# Altium project E_tactile.PrjPcb
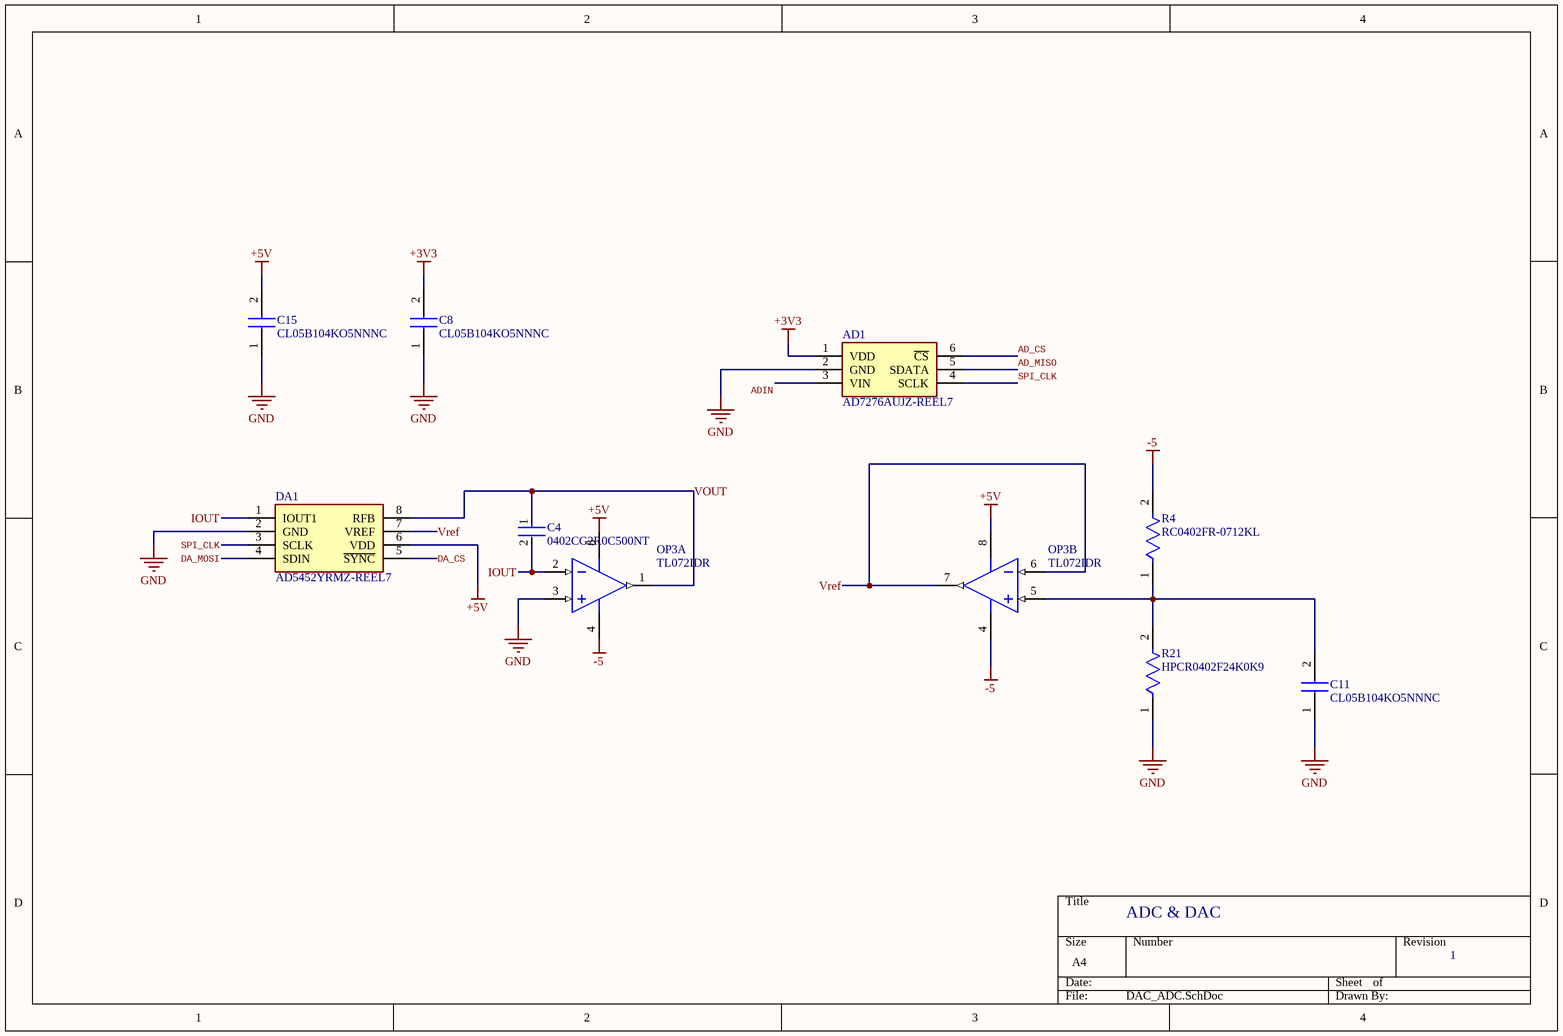
[diagram p0: DAC_ADC.SchDoc]
5 sheets, 67 parts. Net scope: global (net labels, ports and power ports of the same name join across sheets).
Board file: PCB_main_single_side_STACK.PcbDoc
Sheets:
  DAC_ADC.SchDoc
  boost_converter.SchDoc
  current_mirror.SchDoc
  processor.SchDoc
  vreg.SchDoc

## Sheet DAC_ADC.SchDoc
size A4; Revision: 1; SheetNumber: 1; SheetTotal: 5

### Parts
AD1  AD7276AUJZ-REEL7  [SOT95P280X100-6N]
C4  0402CG2R0C500NT  [FP-GJM155-0_05-IPC_C]
C8  CL05B104KO5NNNC  [CAPC1005X55N]
C11  CL05B104KO5NNNC  [CAPC1005X55N]
C15  CL05B104KO5NNNC  [CAPC1005X55N]
DA1  AD5452YRMZ-REEL7  [SOP65P490X110-8N]
OP3  TL072IDR  [D0008A_L]  (parts A,B of 2)
R4  RC0402FR-0712KL  [FP-RC0402-0_4-IPC_C]
R21  HPCR0402F24K0K9  [FP-RT0402-MFG]

### Nets
+3V3: AD1.1(VDD) C8.2
+5V: C15.2 DA1.6(VDD) OP3.8(VCC+)
-5: OP3.4(VCC-) R4.2
GND: AD1.2(GND) C8.1 C11.1 C15.1 DA1.2(GND) OP3.3(IN1+) R21.1
AD_CS: AD1.6(~{CS})
AD_MISO: AD1.5(SDATA)
ADIN: AD1.3(VIN)
DA_CS: DA1.5(~{SYNC})
DA_MOSI: DA1.4(SDIN)
IOUT: C4.2 DA1.1(IOUT1) OP3.2(IN1-)
SPI_CLK: AD1.4(SCLK) DA1.3(SCLK)
VOUT: C4.1 DA1.8(RFB) OP3.1(OUT1)
Vref: DA1.7(VREF) OP3.6(IN2-) OP3.7(OUT2)
NetC11_2: C11.2 OP3.5(IN2+) R4.1 R21.2

### Notes on the sheet
- ADC & DAC
- 1

### Library data of the parts
AD1 = AD7276AUJZ-REEL7: Integrated Circuit; Manufacturer_Name: Analog Devices; Datasheet Link: http://componentsearchengine.com/Datasheets/1/AD7276AUJZ-REEL7.pdf; Height: 1mm; Manufacturer_Part_Number: AD7276AUJZ-REEL7; Mouser Part Number: 584-AD7276AUJZ-R7; Mouser Price/Stock: https://www.mouser.co.uk/ProductDetail/Analog-Devices/AD7276AUJZ-REEL7?qs=NmRFExCfTkGcJMyUALbIIQ%3D%3D; Arrow Part Number: AD7276AUJZ-REEL7; Arrow Price/Stock: https://www.arrow.com/en/products/ad7276aujz-reel7/analog-devices
C4 = CMP-2008-03830-2: Multi-Layer Ceramic Capacitor 2pF C0G  ±0.1pF 0402 Paper T/R; Voltage Rating: 50V; Mount: Surface Mount; REACH SVHC: No SVHC; Lead Pitch: 0.3mm; Length: 1mm; Lead Free: Lead Free; Radiation Hardening: No; Depth: 0.5mm; Thickness: 0.022inch; Number of Pins: 2; Height: 0.5mm; Min Operating Temperature: -55°C; Width: 0.5mm; Packaging: Tape and Reel; Case Code (Metric): 1005; Capacitance: 2pF; Voltage Rating (DC): 50V; Package Quantity: 1; Max Operating Temperature: 125°C; Case/Package: 0402; Case Code (Imperial): 0402; Dielectric: C0G; Termination: SMD/SMT
C8 C11 C15 = CL05B104KO5NNNC: Capacitor; Manufacturer_Name: SAMSUNG; Datasheet Link: https://datasheet.datasheetarchive.com/originals/distributors/Datasheets-DGA10/2408147.pdf; Height: 0.55mm; Manufacturer_Part_Number: CL05B104KO5NNNC; Mouser Part Number: 187-CL05B104KO5NNNC; Mouser Price/Stock: https://www.mouser.co.uk/ProductDetail/Samsung-Electro-Mechanics/CL05B104KO5NNNC?qs=hqM3L16%252BxlfT2SKOuAUq6Q%3D%3D; Arrow Part Number: CL05B104KO5NNNC; Arrow Price/Stock: https://www.arrow.com/en/products/cl05b104ko5nnnc/samsung-electro-mechanics?utm_currency=USD&region=europe
DA1 = AD5452YRMZ-REEL7: Integrated Circuit; Manufacturer_Name: Analog Devices; Datasheet Link: https://componentsearchengine.com/Datasheets/1/AD5452YRMZ-REEL7.pdf; Height: 1.1mm; Manufacturer_Part_Number: AD5452YRMZ-REEL7; Mouser Part Number: 584-AD5452YRMZ-R7; Mouser Price/Stock: https://www.mouser.co.uk/ProductDetail/Analog-Devices/AD5452YRMZ-REEL7?qs=NmRFExCfTkHoityukWLALQ%3D%3D; Arrow Part Number: AD5452YRMZ-REEL7; Arrow Price/Stock: https://www.arrow.com/en/products/ad5452yrmz-reel7/analog-devices?region=nac
OP3 = CMP-0015-00084-2: Dual Low-Noise JFET-Input General-Purpose Operational Amplifier, 7 to 36 V, -40 to 85 degC, 8-pin SOIC (D8), Green (RoHS & no Sb/Br); Manufacturer: Texas Instruments; Number of Channels: 2; Rating: Catalog; IIB(Max)(pA): 200; Total Supply Voltage(Max)(+5V is 5, +/-5V is 10): 36; Vio (25C)(Max)(mV): 6; Iq per channel(Max)(mA): 2.5; Offset Drift(Typ)(uV/C): 18; Total Supply Voltage(Min)(+5V is 5, +/-5V is 10): 7; CMRR(Min)(dB): 75; Slew Rate(Typ)(V/us): 13; Sub Family: General Purpose Amplifier, High Supply Voltage Amplifier (>=30V); GBW(Typ)(MHz): 3; Code_JEDEC: MS-012; Eco-Plan: Green (RoHS & no Sb/Br); Mounting Technology: Surface Mount; ComponentLink3Description: Package Specification; PackageReference: D0008A; ComponentLink2URL: http://www.ti.com/lit/ds/symlink/tl072.pdf; ComponentLink1Description: Manufacturer URL; ComponentLink3URL: http://www.ti.com/litv/pdf/msoi002j; ComponentLink2Description: Datasheet; DatasheetVersion: SLOS080J; ComponentLink1URL: http://www.ti.com/; PackageDescription: 8-Pin Plastic Small Outline, Body 4.9 x 3.9 mm, Pitch 1.27 mm; PackageVersion: 4040047-3/M, 06/2011; Vn at 1kHz(Typ)(nV/rtHz): 18; PartNumber: TL072IDR
R4 = CMP-2002-07378-2: RES SMD 12K OHM 1% 1/16W 0402; Power Rating: 62.5mW; Voltage Rating: 50V; Resistance: 12kR; Max Power Dissipation: 63mW; Temperature Coefficient: 100ppm/°C; Construction: Rectangular; Case Code (Metric): 1005; Package Quantity: 1; Weight: 2.3E-05oz; RoHS Compliant: Yes; Packaging: Tape and Reel; Case Code (Imperial): 0402; Military Standard: Not; Min Operating Temperature: -55°C; Depth: 0.5mm; Length: 1mm; Width: 0.02inch; Termination: SMD/SMT; Lead Free: Lead Free; Tolerance: 1%; REACH SVHC: No SVHC; Size Code: 0402; Resistance Tolerance: 1%; Series: RC; Max Operating Temperature: 155°C; Height: 0.016inch; Features: Moisture Resistant; Number of Terminations: 2; Case/Package: 0402; Resistor Type: Thick Film
R21 = CMP-03412-008661-1: RES SMD 12K OHM 1% 1/16W 0402; Manufacturer: Yageo; Temperature Coefficient: 50 ppm/°C; Voltage Rating: 50V; Tolerance: 0.01; Power Rating: 0.063W; Resistance: 24KΩ; Value: 12KΩ; ComponentLink2Description: Datasheet; Height: 0.35mm; Lead Free: Yes; Package: RT0402; Series: RT; RoHS: TRUE; Manufacturer Part Number: HPCR0402F24K0K9; ComponentLink2URL: http://www.yageo.com/documents/recent/PYu-RT_1-to-0.01_RoHS_L_9.pdf; Temperature Range Low: -55°C; Device Class L1: Passive Components; Temperature Range High: +155°C; Automotive: No; Digikey Description: RES SMD 14K OHM 1% 1/16W 0402; Ipc Land Pattern Name: RESC10050X30; Octopart: https://octopart.com/rt0402fre0714kl-yageo-1378200; Category: Res; Temperature: -55°C to +155°C; Footprint Url: http://www.yageo.com/exep/pages/download/literatures/PYu-R_Mount_10.pdf; Device Class L3: Chip SMD Resistors; Composition: Thin Film; Device Class L2: Resistors

## Sheet boost_converter.SchDoc
size A4; SheetNumber: 2; SheetTotal: 5
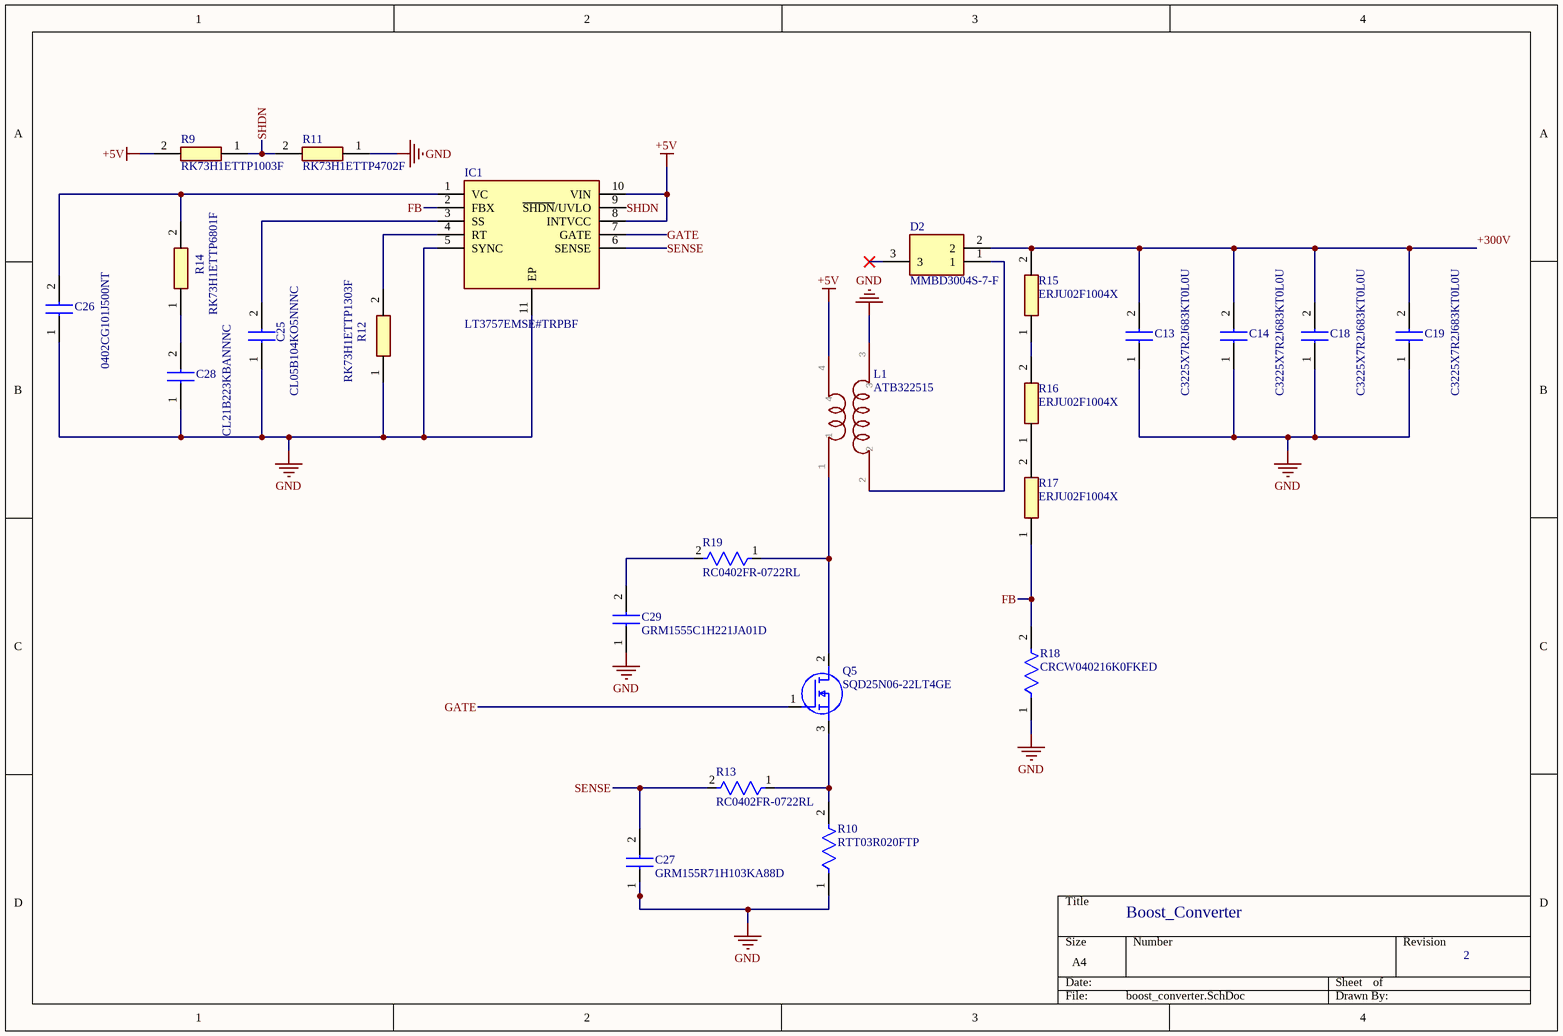
[diagram p1: boost_converter.SchDoc]

### Parts
C13  C3225X7R2J683KT0L0U  [CAPC3225X200N]
C14  C3225X7R2J683KT0L0U  [CAPC3225X200N]
C18  C3225X7R2J683KT0L0U  [CAPC3225X200N]
C19  C3225X7R2J683KT0L0U  [CAPC3225X200N]
C25  CL05B104KO5NNNC  [CAPC1005X55N]
C26  0402CG101J500NT  [CAPC1005X55N]
C27  GRM155R71H103KA88D  [GRM15x]
C28  CL21B223KBANNNC  [CAPC2012X75N]
C29  GRM1555C1H221JA01D  [CAPC1005X70N]
D2  MMBD3004S-7-F  [SOT96P240X100-3N]
IC1  LT3757EMSE#TRPBF  [SOP50P490X110-11N]
L1  ATB322515  [ATB322515]
Q5  SQD25N06-22LT4GE  [IPD25N06S4L30ATMA2]
R9  RK73H1ETTP1003F  [RESC1005X40N]
R10  RTT03R020FTP  [FP-PA0402-MFG]
R11  RK73H1ETTP4702F  [RESC1005X40N]
R12  RK73H1ETTP1303F  [RESC1005X40N]
R13  RC0402FR-0722RL  [FP-RC0402-0_4-MFG]
R14  RK73H1ETTP6801F  [RESC1005X40N]
R15  ERJU02F1004X  [ERJS02_U02_(0402)]
R16  ERJU02F1004X  [ERJS02_U02_(0402)]
R17  ERJU02F1004X  [ERJS02_U02_(0402)]
R18  CRCW040216K0FKED  [FP-CRCW0402-e3-IPC_C]
R19  RC0402FR-0722RL  [FP-RC0402-0_4-MFG]

### Nets
+5V: IC1.8(INTVCC) IC1.10(VIN) L1.4 R9.2
GND: C13.1 C14.1 C18.1 C19.1 C25.1 C26.1 C27.1 C28.1 C29.1 IC1.5(SYNC) IC1.11(EP) L1.3 R10.1 R11.1 R12.1 R18.1
+300V: C13.2 C14.2 C18.2 C19.2 D2.2 R15.2
FB: IC1.2(FBX) R17.1 R18.2
GATE: IC1.7(GATE) Q5.1(G)
SENSE: C27.2 IC1.6(SENSE) R13.2
SHDN: IC1.9(~{SHDN}/UVLO) R9.1 R11.2
NetC25_2: C25.2 IC1.3(SS)
NetC26_2: C26.2 IC1.1(VC) R14.2
NetC28_2: C28.2 R14.1
NetC29_2: C29.2 R19.2
NetD2_1: D2.1 L1.2
NetIC1_4: IC1.4(RT) R12.2
NetL1_1: L1.1 Q5.2(D) R19.1
NetQ5_3: Q5.3(S) R10.2 R13.1
NetR15_1: R15.1 R16.2
NetR16_1: R16.1 R17.2

Not connected (* = marked no-connect by the designer): D2 3*

### Notes on the sheet
- Boost_Converter
- 2

### Library data of the parts
C13 C14 C18 C19 = C3225X7R2J683K200AA: Capacitor; Manufacturer_Name: TDK; Datasheet Link: https://product.tdk.com/info/en/catalog/datasheets/mlcc_commercial_midvoltage_en.pdf; Height: 2mm; Manufacturer_Part_Number: C3225X7R2J683K200AA; Mouser Part Number: 810-C3225X7R2J683K; Mouser Price/Stock: https://www.mouser.com/Search/Refine.aspx?Keyword=810-C3225X7R2J683K; Arrow Part Number: C3225X7R2J683K200AA; Arrow Price/Stock: https://www.arrow.com/en/products/c3225x7r2j683k200aa/tdk?region=nac
C25 = CL05B104KO5NNNC: Capacitor; Manufacturer_Name: SAMSUNG; Datasheet Link: https://datasheet.datasheetarchive.com/originals/distributors/Datasheets-DGA10/2408147.pdf; Height: 0.55mm; Manufacturer_Part_Number: CL05B104KO5NNNC; Mouser Part Number: 187-CL05B104KO5NNNC; Mouser Price/Stock: https://www.mouser.co.uk/ProductDetail/Samsung-Electro-Mechanics/CL05B104KO5NNNC?qs=hqM3L16%252BxlfT2SKOuAUq6Q%3D%3D; Arrow Part Number: CL05B104KO5NNNC; Arrow Price/Stock: https://www.arrow.com/en/products/cl05b104ko5nnnc/samsung-electro-mechanics?utm_currency=USD&region=europe
C26 = 0402CG101J500NT: Capacitor; Manufacturer_Name: Guangdong Fenghua Advanced Tech; Datasheet Link: https://datasheet.lcsc.com/szlcsc/Guangdong-Fenghua-Advanced-Tech-0402CG101J500NT_C1546.pdf; Height: 0.55mm; Manufacturer_Part_Number: 0402CG101J500NT
C27 = GRM155R71H103KA88D: Capacitor; Manufacturer_Name: Murata Electronics; Datasheet Link: https://search.murata.co.jp/Ceramy/image/img/A01X/G101/ENG/GRM155R71H103KA88-01A.pdf; Height: 0.33mm; Manufacturer_Part_Number: GRM155R71H103KA88D; Mouser Part Number: 81-GRM155R71H103KA8D; Mouser Price/Stock: https://www.mouser.co.uk/ProductDetail/Murata-Electronics/GRM155R71H103KA88D?qs=Dfh4SrgScWxOVlCuzd3ZyQ%3D%3D; Arrow Part Number: GRM155R71H103KA88D; Arrow Price/Stock: https://www.arrow.com/en/products/grm155r71h103ka88d/murata-manufacturing?utm_currency=USD&region=nac
C28 = CL21B223KBANNNC: Capacitor; Manufacturer_Name: SAMSUNG; Datasheet Link: https://datasheet.datasheetarchive.com/originals/distributors/Datasheets_SAMA/f1186cf82a02fbe5c02a084f1b7bc7a5.pdf; Height: 0.75mm; Manufacturer_Part_Number: CL21B223KBANNNC; Mouser Part Number: 187-CL21B223KBANNNC; Mouser Price/Stock: https://www.mouser.co.uk/ProductDetail/Samsung-Electro-Mechanics/CL21B223KBANNNC?qs=349EhDEZ59o8NyW%2FjkRQDg%3D%3D; Arrow Part Number: CL21B223KBANNNC; Arrow Price/Stock: https://www.arrow.com/en/products/cl21b223kbannnc/samsung-electro-mechanics?utm_currency=USD&region=europe
C29 = GRM1555C1H221JA01D: Capacitor; Manufacturer_Name: Murata Electronics; Datasheet Link: https://search.murata.co.jp/Ceramy/image/img/A01X/G101/ENG/GRM1555C1H221JA01-01A.pdf; Height: 0.7mm; Manufacturer_Part_Number: GRM1555C1H221JA01D; Mouser Part Number: 81-GRM1555C1H221JA01; Mouser Price/Stock: https://www.mouser.co.uk/ProductDetail/Murata-Electronics/GRM1555C1H221JA01D?qs=AflYu6BMgmkFaPorbrBIOQ%3D%3D; Arrow Part Number: GRM1555C1H221JA01D; Arrow Price/Stock: https://www.arrow.com/en/products/grm1555c1h221ja01d/murata-manufacturing
D2 = MMBD3004S-7-F: Diode; Manufacturer_Name: Diodes Incorporated; Datasheet Link: http://www.farnell.com/datasheets/1911713.pdf; Height: 1mm; Manufacturer_Part_Number: MMBD3004S-7-F; Mouser Part Number: 621-MMBD3004S-F; Mouser Price/Stock: https://www.mouser.co.uk/ProductDetail/Diodes-Incorporated/MMBD3004S-7-F?qs=wlBvdarPgLYI%252BR4SoNTV%2Fg%3D%3D; Arrow Part Number: MMBD3004S-7-F; Arrow Price/Stock: https://www.arrow.com/en/products/mmbd3004s-7-f/diodes-incorporated
IC1 = LT3757EMSETRPBF: Integrated Circuit; Manufacturer_Name: Analog Devices; Height: 1.1mm; Manufacturer_Part_Number: LT3757EMSETRPBF
Q5 = IPD25N06S4L30ATMA2: 60V 25A 30mΩ@10V 2.5V 1PCSNChannel TO252-2L MOSFETs ROHS; Manufacturer_Name: Infineon; Manufacturer_Part_Number: 25N06; Datasheet Link: https://www.infineon.com/dgdl/Infineon-IPD25N06S4L-30-DS-v01_01-EN.pdf?fileId=db3a30431ff98815012038898f7b0caa; Height: 2.5mm; Mouser Part Number: IPD25N06S4L30ATMA2; Mouser Price/Stock: https://www.mouser.co.uk/ProductDetail/Infineon-Technologies/IPD25N06S4L30ATMA2?qs=OwbwYO03UsKv1XP00b%252BqYQ%3D%3D; Arrow Part Number: 25N06; Arrow Price/Stock: https://www.arrow.com/en/products/ipd25n06s4l30atma2/infineon-technologies-ag?region=nac
R9 = RK73H1ETTP1003F: Resistor; Manufacturer_Name: KOA Speer; Datasheet Link: http://www.koaspeer.com/catimages/Products/RK73-RT/RK73-RT.pdf; Height: 0.4mm; Manufacturer_Part_Number: RK73H1ETTP1003F; Mouser Part Number: 660-RK73H1ETTP1003F; Mouser Price/Stock: https://www.mouser.co.uk/ProductDetail/KOA-Speer/RK73H1ETTP1003F?qs=b1MjUb3%252BcaVl%2FZYcKgjmuQ%3D%3D; Arrow Part Number: RK73H1ETTP1003F; Arrow Price/Stock: https://www.arrow.com/en/products/rk73h1ettp1003f/koa-speer-electronics?region=nac
R10 = CMP-03412-023933-1: METAL CURRENT SENSOR 0402 1% 150; Manufacturer: Yageo; Value: 20mΩ; Temperature Coefficient: 150ppm/°C; Power Rating: 0.167W; Series: PA0402; Category: Res; RoHS: TRUE; Ipc Land Pattern Name: RESC10055X40; Composition: Metal Element; Manufacturer Part Number: RTT03R020FTP; Temperature Range High: +125°C; Device Class L1: Passive Components; Package: PA0402; Height: 0.4mm; Temperature: -55°C to +125°C; Device Class L3: Chip SMD Resistors; Tolerance: 1%; Automotive: No; Lead Free: Yes; Digikey Description: METAL CURRENT SENSOR 0402 1% 150; Octopart: https://octopart.com/pa0402frl7t0r02l-yageo-86729964; Resistance: 20mΩ; Temperature Range Low: -55°C; ComponentLink2URL: http://www.yageo.com/documents/recent/PYu-PA0402_L_51_RoHS_0.pdf; Device Class L2: Resistors; ComponentLink2Description: Datasheet
R11 = RK73H1ETTP4702F: Resistor; Manufacturer_Name: KOA Speer; Datasheet Link: http://www.koaspeer.com/catimages/Products/RK73-RT/RK73-RT.pdf; Height: 0.4mm; Manufacturer_Part_Number: RK73H1ETTP4702F; Mouser Part Number: 660-RK73H1ETTP4702F; Mouser Price/Stock: https://www.mouser.co.uk/ProductDetail/KOA-Speer/RK73H1ETTP4702F?qs=VhCg8p3QXBbdph5DclKeLw%3D%3D; Arrow Part Number: RK73H1ETTP4702F; Arrow Price/Stock: https://www.arrow.com/en/products/rk73h1ettp4702f/koa-speer-electronics
R12 = RK73H1ETTP1303F: Resistor; Manufacturer_Name: KOA Speer; Datasheet Link: http://www.koaspeer.com/catimages/Products/RK73-RT/RK73-RT.pdf; Height: 0.4mm; Manufacturer_Part_Number: RK73H1ETTP1303F; Mouser Part Number: 660-RK73H1ETTP1303F; Mouser Price/Stock: https://www.mouser.co.uk/ProductDetail/KOA-Speer/RK73H1ETTP1303F?qs=nWTjSGqwIiQKngPNRzbM%2FA%3D%3D
R13 R19 = CMP-2002-07520-2: Tolerance: 1%; Power Rating: 63mW; Voltage Rating: 50V; Temperature Coefficient: 100ppm/°C; Resistance: 22Ω; Termination: SMD/SMT; Depth: 500µm; Packaging: Tape & Reel; Height: 400µm; Width: 500µm; Case Code (Imperial): 0402; Length: 1mm; Schedule B: 8533210045, 8533210045; Case/Package: 0402; Max Operating Temperature: 155°C; Min Operating Temperature: -55°C; REACH SVHC: Unknown; RoHS: Compliant; Military Standard: Not; Voltage Rating (DC): 50V; Lead Free: Lead Free; Voltage Rating (AC): 50V; Number of Pins: 2; Composition: Thick Film
R14 = RK73H1ETTP6801F: Resistor; Manufacturer_Name: KOA Speer; Datasheet Link: http://www.koaspeer.com/catimages/Products/RK73-RT/RK73-RT.pdf; Height: 0.4mm; Manufacturer_Part_Number: RK73H1ETTP6801F; Mouser Part Number: 660-RK73H1ETTP6801F; Mouser Price/Stock: https://www.mouser.com/Search/Refine.aspx?Keyword=660-RK73H1ETTP6801F; Arrow Part Number: RK73H1ETTP6801F; Arrow Price/Stock: https://www.arrow.com/en/products/rk73h1ettp6801f/koa-speer-electronics
R15-R17 = ERJU02F1004X: Resistor; Manufacturer_Name: Panasonic; Datasheet Link: https://industrial.panasonic.com/cdbs/www-data/pdf/RDP0000/AOA0000C334.pdf; Height: 0.4mm; Manufacturer_Part_Number: ERJU02F1004X
R18 = CMP-1011-00644-3: RES Thick Film, 16kΩ, 1%, 0.063W, 100ppm/°C, 0402; Voltage Rating: 50V; Max Power Dissipation: 63mW; Resistance: 16kR; Military Standard: Not; Contact Plating: Tin; Mount: Surface Mount; Termination: SMD/SMT; Length: 1mm; Composition: Thick Film; Package Quantity: 10; Case Code (Imperial): 0402; Min Operating Temperature: -55°C; Depth: 0.5mm; Case/Package: 0402; Power Rating: 63mW; Radiation Hardening: No; Lead Free: Lead Free; Voltage Rating (DC): 50V; Packaging: Tape and Reel; Height: 0.35mm; Max Operating Temperature: 155°C; Width: 0.02inch; Number of Terminations: 2; Tolerance: 1%; Weight: 2.3E-05oz; Temperature Coefficient: 100ppm/°C; Number of Pins: 2; Features: Automotive AEC-Q200; Case Code (Metric): 1005

## Sheet current_mirror.SchDoc
size A4; Revision: 1; SheetNumber: 3; SheetTotal: 5
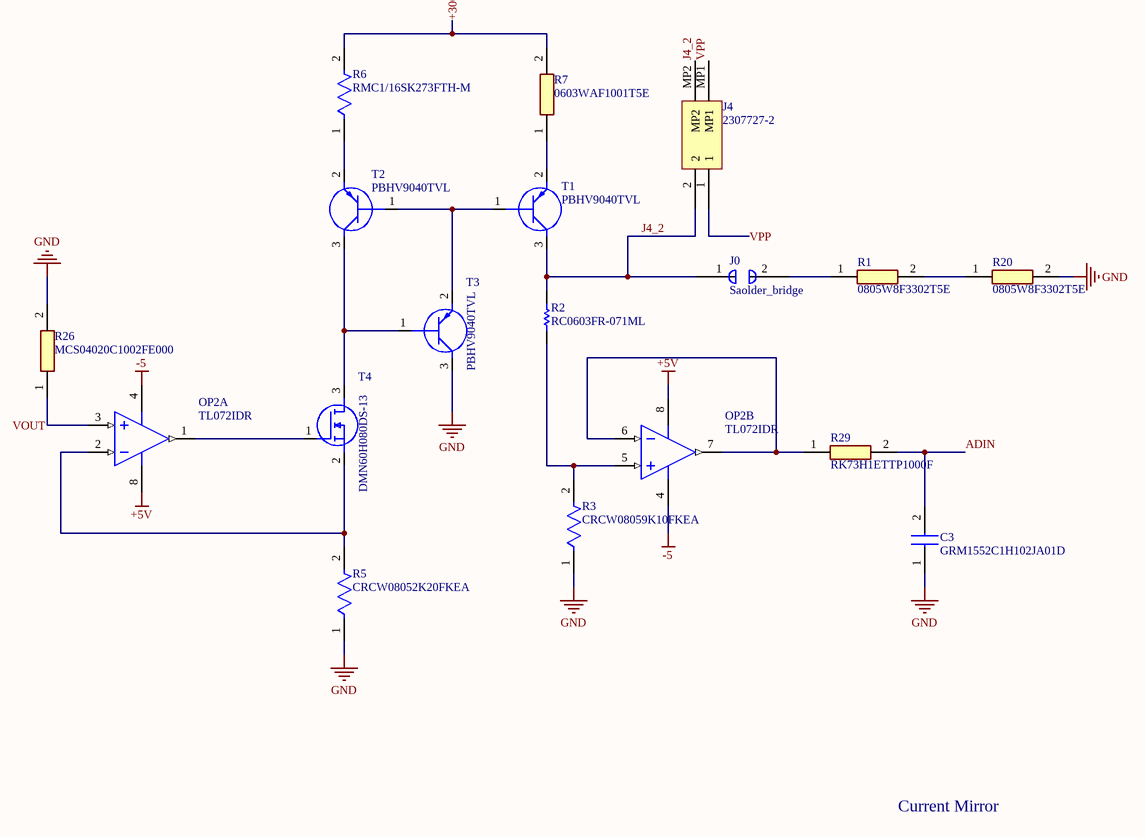
[diagram p2: current_mirror.SchDoc]

### Parts
C3  GRM1552C1H102JA01D  [CAPC1005X70N]
J0  Saolder_bridge  [Solder Bridge]
J4  2307727-2  [2307727-2]
OP2  TL072IDR  [D0008A_L]  (parts A,B of 2)
R1  0805W8F3302T5E  [RESC2013X65N]
R2  RC0603FR-071ML  [RESC1608X55X25LL10T15]
R3  CRCW08059K10FKEA  [FP-CRCW0805-e3-IPC_C]
R5  CRCW08052K20FKEA  [FP-CRCW0805-e3-IPC_B]
R6  RMC1/16SK273FTH-M  [FP-CRCW0402-e3-IPC_A]
R7  0603WAF1001T5E  [RESC1608X55N]
R20  0805W8F3302T5E  [RESC2013X65N]
R26  MCS04020C1002FE000  [RESC1005X37N]
R29  RK73H1ETTP1000F  [RESC1005X40N]
T1  PBHV9040TVL  [SOT95P230X110-3N]
T2  PBHV9040TVL  [SOT95P230X110-3N]
T3  PBHV9040TVL  [SOT95P230X110-3N]
T4  DMN60H080DS-13  [SOT96P240X110-3N]

### Nets
+5V: OP2.8(VCC+)
-5: OP2.4(VCC-)
GND: C3.1 R3.1 R5.1 R20.2 R26.2 T3.3(C)
+300V: R6.2 R7.2
ADIN: C3.2 R29.2
J4_2: J0.1 J4.2 J4.MP2 R2.2 T1.3(C)
VOUT: OP2.3(IN1+) R26.1
VPP: J4.1 J4.MP1
NetJ0_2: J0.2 R1.1
NetOP2_1: OP2.1(OUT1) T4.1(G)
NetOP2_2: OP2.2(IN1-) R5.2 T4.2(S)
NetOP2_5: OP2.5(IN2+) R2.1 R3.2
NetOP2_6: OP2.6(IN2-) OP2.7(OUT2) R29.1
NetR1_2: R1.2 R20.1
NetR6_1: R6.1 T2.2(E)
NetR7_1: R7.1 T1.2(E)
NetT1_1: T1.1(B) T2.1(B) T3.2(E)
NetT2_3: T2.3(C) T3.1(B) T4.3(D)

### Notes on the sheet
- Current Mirror

### Library data of the parts
C3 = GRM1552C1H102JA01D: Capacitor; Manufacturer_Name: Murata Electronics; Datasheet Link: https://search.murata.co.jp/Ceramy/image/img/A01X/G101/ENG/GRM1552C1H102JA01-01A.pdf; Height: 0.7mm; Manufacturer_Part_Number: GRM1552C1H102JA01D; Mouser Part Number: N/A; Mouser Price/Stock: https://www.mouser.co.uk/ProductDetail/Murata-Electronics/GRM1552C1H102JA01D?qs=UOvNgVTuGCqGiG7fJ8%252BtBQ%3D%3D
J0 = Component_1
J4 = 2307727-2: Connector
OP2 = CMP-0015-00084-2: as OP3 on sheet DAC_ADC; Code_JEDEC: MS-012; Eco-Plan: Green (RoHS & no Sb/Br); Mounting Technology: Surface Mount; ComponentLink3Description: Package Specification; PackageReference: D0008A; ComponentLink2URL: http://www.ti.com/lit/ds/symlink/tl072.pdf; ComponentLink1Description: Manufacturer URL; ComponentLink3URL: http://www.ti.com/litv/pdf/msoi002j; ComponentLink2Description: Datasheet; DatasheetVersion: SLOS080J; ComponentLink1URL: http://www.ti.com/; PackageDescription: 8-Pin Plastic Small Outline, Body 4.9 x 3.9 mm, Pitch 1.27 mm; PackageVersion: 4040047-3/M, 06/2011; Vn at 1kHz(Typ)(nV/rtHz): 18; PartNumber: TL072IDR
R1 R20 = 0805W8F3302T5E: Resistor; Manufacturer_Name: UNI-ROYAL(Uniroyal Elec); Datasheet Link: https://datasheet.lcsc.com/lcsc/2110251830_UNI-ROYAL-Uniroyal-Elec-0805W8F3302T5E_C17633.pdf; Height: 0.65mm; Manufacturer_Part_Number: 0805W8F3302T5E
R2 = CMP-1659-00056-1: Chip Resistor, 1 MOhm, +/- 1%, 100 mW, -55 to 155 degC, 0603 (1608 Metric), RoHS, Tape and Reel; Voltage Rating (DC): 25 V; Tolerance: 20%; Case\Package: Radial; Capacitance: 1 mF; Min Operating Temperature: -40 degC; PackageDescription: 2-Pin Surface Mount Device, Body 1.6 x 0.8 mm; ComponentLink1Description: Manufacturer URL; Radiation Hardening: No; DatasheetVersion: Rev. 4, 02/2016; REACH SVHC: No SVHC; Length: 20 mm; Max Operating Temperature: 85 degC; Diameter: 10 mm; Packaging: Bulk; Package Quantity: 200; PackageReference: 0603; Mount: Through Hole; ComponentLink1URL: http://www.yageo.com/; ComponentLink2URL: http://www.yageo.com/documents/recent/PYu-RC_Group_51_RoHS_L_04.pdf; ComponentLink2Description: Datasheet; Width: 0 inch; Lead Pitch: 5 mm; RoHSCompliant: true; Voltage Rating: 25 V; Height: 20 mm
R3 = CMP-2001-04176-2: RES Thick Film, 9.1kΩ, 1%, 0.125W, 100ppm/°C, 0805; Max Power Dissipation: 125mW; Voltage Rating (DC): 150V; Resistance: 9.1kR; Max Operating Temperature: 155°C; Termination: SMD/SMT; Height: 0.45mm; Package Quantity: 10; Radiation Hardening: No; Features: Automotive AEC-Q200; Depth: 1.25mm; Lead Free: Lead Free; Composition: Thick Film; Case Code (Metric): 2012; Tolerance: 1%; Military Standard: Not; Min Operating Temperature: -55°C; Case/Package: 0805; Length: 2mm; Case Code (Imperial): 0805; Voltage Rating: 150V; Contact Plating: Tin; Packaging: Tape and Reel; Number of Terminations: 2; Power Rating: 125mW; Width: 0.049inch; Temperature Coefficient: 100ppm/°C; Weight: 0.000194oz
R5 = CMP-2001-03760-2: RES Thick Film, 2.2kΩ, 1%, 0.125W, 100ppm/°C, 0805; Voltage Rating (DC): 150V; Max Power Dissipation: 125mW; Resistance: 2.2kR; Case/Package: 0805; Width: 1.25mm; Voltage Rating: 150V; Composition: Thick Film; Power Rating: 125mW; Packaging: Tape and Reel; Min Operating Temperature: -55°C; Contact Plating: Tin; Tolerance: 1%; Military Standard: Not; Case Code (Metric): 2012; Radiation Hardening: No; Termination: SMD/SMT; Lead Free: Lead Free; Case Code (Imperial): 0805; Max Operating Temperature: 155°C; Depth: 1.25mm; Weight: 0.000194oz; Number of Terminations: 2; Length: 2mm; Package Quantity: 10; Temperature Coefficient: 100ppm/°C; Features: Automotive AEC-Q200; Height: 0.45mm
R6 = CMP-2002-08431-2: RES Thick Film, 27kΩ, 1%, 0.063W, 100ppm/°C, 0402; Resistance: 27kR; Power Rating: 63mW; Voltage Rating: 50V; Military Standard: Not; Height: 0.35mm; Packaging: Tape and Reel; Case/Package: 0402; Temperature Coefficient: 100ppm/°C; Composition: Thick Film; Mount: Surface Mount; Features: Automotive AEC-Q200; Tolerance: 1%; Contact Plating: Tin; Radiation Hardening: No; Depth: 0.5mm; Termination: SMD/SMT; Width: 0.02inch; Package Quantity: 10; Min Operating Temperature: -55°C; Case Code (Metric): 1005; Lead Free: Lead Free; Voltage Rating (DC): 50V; Max Operating Temperature: 155°C; Weight: 2.3E-05oz; Case Code (Imperial): 0402; Length: 1mm; Number of Terminations: 2; Max Power Dissipation: 63mW; Number of Pins: 2
R7 = 0603WAF1001T5E: Resistor; Manufacturer_Name: UNI-ROYAL(Uniroyal Elec); Datasheet Link: https://datasheet.lcsc.com/szlcsc/Uniroyal-Elec-0603WAF1001T5E_C21190.pdf; Height: 0.55mm; Manufacturer_Part_Number: 0603WAF1001T5E
R26 = MCS04020C1002FE000: Resistor; Manufacturer_Name: Vishay; Datasheet Link: http://www.vishay.com/docs/28705/mcx0x0xpro.pdf; Height: 0.37mm; Manufacturer_Part_Number: MCS04020C1002FE000; Mouser Part Number: 594-MCS04020C1002FE0; Mouser Price/Stock: https://www.mouser.co.uk/ProductDetail/Vishay-Beyschlag/MCS04020C1002FE000?qs=7ZE6F4QMOBZ3EZwk%252BYP9Dg%3D%3D; Arrow Part Number: MCS04020C1002FE000; Arrow Price/Stock: https://www.arrow.com/en/products/mcs04020c1002fe000/vishay?utm_currency=USD&region=nac
R29 = RK73H1ETTP1000F: Resistor; Manufacturer_Name: KOA Speer; Datasheet Link: http://www.koaspeer.com/catimages/Products/RK73-RT/RK73-RT.pdf; Height: 0.4mm; Manufacturer_Part_Number: RK73H1ETTP1000F; Mouser Part Number: 660-RK73H1ETTP1000F; Mouser Price/Stock: https://www.mouser.co.uk/ProductDetail/KOA-Speer/RK73H1ETTP1000F?qs=VhCg8p3QXBZstDOVIJ3D7A%3D%3D; Arrow Part Number: RK73H1ETTP1000F; Arrow Price/Stock: https://www.arrow.com/en/products/rk73h1ettp1000f/koa-speer-electronics?region=nac
T1-T3 = PBHV9040TVL: Transistor BJT PNP; Manufacturer_Name: Nexperia; Datasheet Link: https://assets.nexperia.com/documents/data-sheet/PBHV9040T.pdf; Height: 1.1mm; Manufacturer_Part_Number: PBHV9040TVL; Mouser Part Number: 771-PBHV9040TVL; Mouser Price/Stock: https://www.mouser.co.uk/ProductDetail/Nexperia/PBHV9040TVL?qs=PqoDHHvF64%252B9n13F%2FsjH6g%3D%3D
T4 = DMN60H080DS-13: MOSFET (N-Channel); Manufacturer_Name: Diodes Incorporated; Datasheet Link: https://www.diodes.com//assets/Datasheets/DMN60H080DS.pdf; Height: 1.1mm; Manufacturer_Part_Number: DMN60H080DS-13; Mouser Part Number: 621-DMN60H080DS-13; Mouser Price/Stock: https://www.mouser.co.uk/ProductDetail/Diodes-Incorporated/DMN60H080DS-13?qs=HXFqYaX1Q2wO6tm1AgR7Fw%3D%3D; Arrow Part Number: DMN60H080DS-13; Arrow Price/Stock: https://www.arrow.com/en/products/dmn60h080ds-13/diodes-incorporated

## Sheet processor.SchDoc
size A4; Revision: 1; SheetNumber: 4; SheetTotal: 5
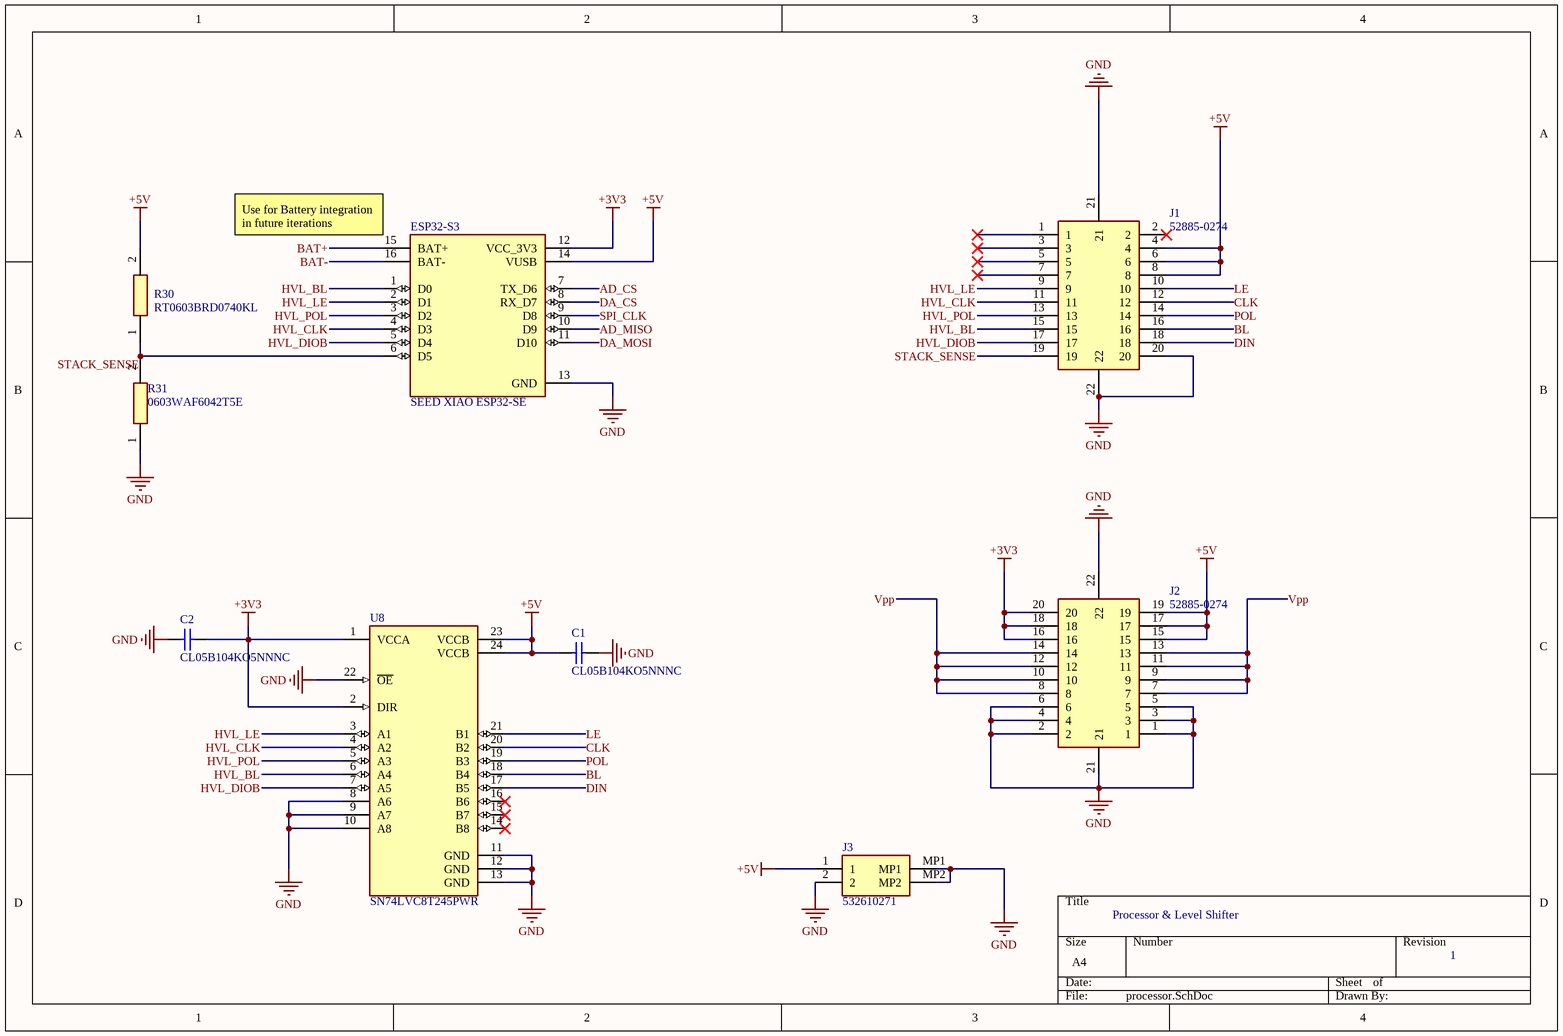
[diagram p3: processor.SchDoc]

### Parts
C1  CL05B104KO5NNNC  [CAPC1050X55X23ML05T13]
C2  CL05B104KO5NNNC  [CAPC1050X55X23ML05T13]
ESP32-S3  SEED XIAO ESP32-SE  [PCBComponent_1]
J1  52885-0274  [528850274]
J2  52885-0274  [528850274]
J3  532610271  [532610271]
R30  RT0603BRD0740KL  [RESC1608X55N]
R31  0603WAF6042T5E  [RESC1608X55N]
U8  SN74LVC8T245PWR  [FP-PW0024A-MFG]

### Nets
+3V3: C2.2 ESP32-S3.12(VCC_3V3) J2.16 J2.18 J2.20 U8.1(VCCA) U8.2(DIR)
+5V: C1.1 ESP32-S3.14(VUSB) J1.4 J1.6 J1.8 J2.15 J2.17 J2.19 J3.1 R30.2 U8.23(VCCB) U8.24(VCCB)
GND: C1.2 C2.1 ESP32-S3.13(GND) J1.20 J1.21 J1.22 J2.1 J2.2 J2.3 J2.4 J2.5 J2.6 J2.21 J2.22 J3.2 J3.MP1 J3.MP2 R31.1 U8.8(A6) U8.9(A7) U8.10(A8) U8.11(GND) U8.12(GND) U8.13(GND) U8.22(~{OE})
AD_CS: ESP32-S3.7(TX_D6)
AD_MISO: ESP32-S3.10(D9)
BAT+: ESP32-S3.15(BAT+)
BAT-: ESP32-S3.16(BAT-)
BL: J1.16 U8.18(B4)
CLK: J1.12 U8.20(B2)
DA_CS: ESP32-S3.8(RX_D7)
DA_MOSI: ESP32-S3.11(D10)
DIN: J1.18 U8.17(B5)
HVL_BL: ESP32-S3.1(D0) J1.15 U8.6(A4)
HVL_CLK: ESP32-S3.4(D3) J1.11 U8.4(A2)
HVL_DIOB: ESP32-S3.5(D4) J1.17 U8.7(A5)
HVL_LE: ESP32-S3.2(D1) J1.9 U8.3(A1)
HVL_POL: ESP32-S3.3(D2) J1.13 U8.5(A3)
LE: J1.10 U8.21(B1)
POL: J1.14 U8.19(B3)
SPI_CLK: ESP32-S3.9(D8)
STACK_SENSE: ESP32-S3.6(D5) J1.19 R30.1 R31.2
VPP: J2.7 J2.8 J2.9 J2.10 J2.11 J2.12 J2.13 J2.14

Not connected (* = marked no-connect by the designer): J1 1* 2* 3* 5* 7*; U8 14(B8)* 15(B7)* 16(B6)*

### Notes on the sheet
- (near ESP32-S3) Use for Battery integration in future iterations
- Processor & Level Shifter

### Library data of the parts
C1 C2 = CMP-2000-05439-1: Chip Capacitor, 100 nF, +/- 10%, 16 V, -55 to 125 degC, 0402 (1005 Metric), RoHS, Tape and Reel; Manufacturer: Samsung Electro-Mechanics; Capacitance: 100000pF; Dielectric: X7R; Rated Voltage: 16V; Case Size/Dimension: 0402; Tolerance (%): ±10%; Manufacturer URL: http://www.samsungsem.com/global/index.jsp; Datasheet URL: https://datasheet.ciiva.com/29198/458718-da-01-en-vs-kondensator-0402-29198423.pdf; Datasheet Version: Nov-10
ESP32-S3 = Component_1
J1 J2 = 52885-0274: Connector; Manufacturer_Name: Molex; Datasheet Link: https://www.molex.com/webdocs/datasheets/pdf/en-us/0528850274_PCB_RECEPTACLES.pdf; Height: 4mm; Manufacturer_Part_Number: 52885-0274; Mouser Part Number: 538-52885-0274; Mouser Price/Stock: https://www.mouser.co.uk/ProductDetail/Molex/52885-0274?qs=%252BPJ3Ll1xQNYiQig4hWY5jQ%3D%3D
J3 = 53261-0271: C177225; Manufacturer_Name: Molex; Datasheet Link: https://www.molex.com/pdm_docs/sd/532610271_sd.pdf; Height: 3.65mm; Manufacturer_Part_Number: 53261-0271; Mouser Part Number: 538-53261-0271; Mouser Price/Stock: https://www.mouser.co.uk/ProductDetail/Molex/53261-0271?qs=%252B72YyncTwW%252B8%252BBjraxGf3A%3D%3D; Arrow Part Number: 53261-0271; Arrow Price/Stock: https://www.arrow.com/en/products/53261-0271/molex?region=nac
R30 = RT0603BRD0740KL: Resistor; Manufacturer_Name: YAGEO; Datasheet Link: https://www.yageo.com/upload/media/product/app/datasheet/rchip/pyu-rt_1-to-0.01_rohs_l.pdf; Height: 0.55mm; Manufacturer_Part_Number: RT0603BRD0740KL; Mouser Part Number: 603-RT0603BRD0740KL; Mouser Price/Stock: https://www.mouser.co.uk/ProductDetail/YAGEO/RT0603BRD0740KL?qs=gt1LBUVyoHlX7zH8R4KgIw%3D%3D; Arrow Part Number: RT0603BRD0740KL; Arrow Price/Stock: https://www.arrow.com/en/products/rt0603brd0740kl/yageo?region=nac
R31 = MCT06030C6042FP500: Resistor; Manufacturer_Name: Vishay; Datasheet Link: http://www.vishay.com/docs/28705/mcx0x0xpro.pdf; Height: 0.55mm; Manufacturer_Part_Number: 0603WAF6042T5E; Mouser Part Number: 0603WAF6042T5E
U8 = CMP-04899-000027-1: IC TRNSLTR BIDIRECTIONAL 24TSSOP; Manufacturer: Texas Instruments; V B Min: 1.65V; V B Max: 5.5V; Number Of Outputs: 8; Standoff Height: 0.05mm; Nominal Supply Current: 25uA; Number Of Circuits: 1; Propagation Delay: 4.3ns; Logic Function Desc: Non-Inverting; Ambient Temperature Range High: +85°C; Temperature Range Low: -40°C; Category: IC; Min Supply Voltage: 1.65V; Device Class L2: Logic ICs; Digikey Description: IC TRNSLTR BIDIRECTIONAL 24TSSOP; ComponentLink2Description: Datasheet; V A Min: 1.65V; Height: 1.2mm; Device Class L1: Integrated Circuits (ICs); Manufacturer Part Number: SN74LVC8T245PWR; Ipc Land Pattern Name: SOP65P640X120-24; Lead Free: Yes; Device Class L3: Voltage Level Shifters; Octopart: https://octopart.com/sn74lvc8t245pwr-texas+instruments-517164; RoHS: TRUE; Ambient Temperature Range Low: -40°C; Number Of Inputs: 8; Automotive: No; V A Max: 5.5V; Mouser Description: Translation - Voltage Levels 8-Bit Dual-Supply Bus Xcvr; Temperature Range High: +85°C; ComponentLink2URL: http://www.ti.com/lit/ds/symlink/sn74lvc8t245.pdf; Temperature: -40°C to +85°C; Package: PW0024A; Max Supply Voltage: 5.5V

## Sheet vreg.SchDoc
size A4; Revision: 1; SheetNumber: 5; SheetTotal: 5
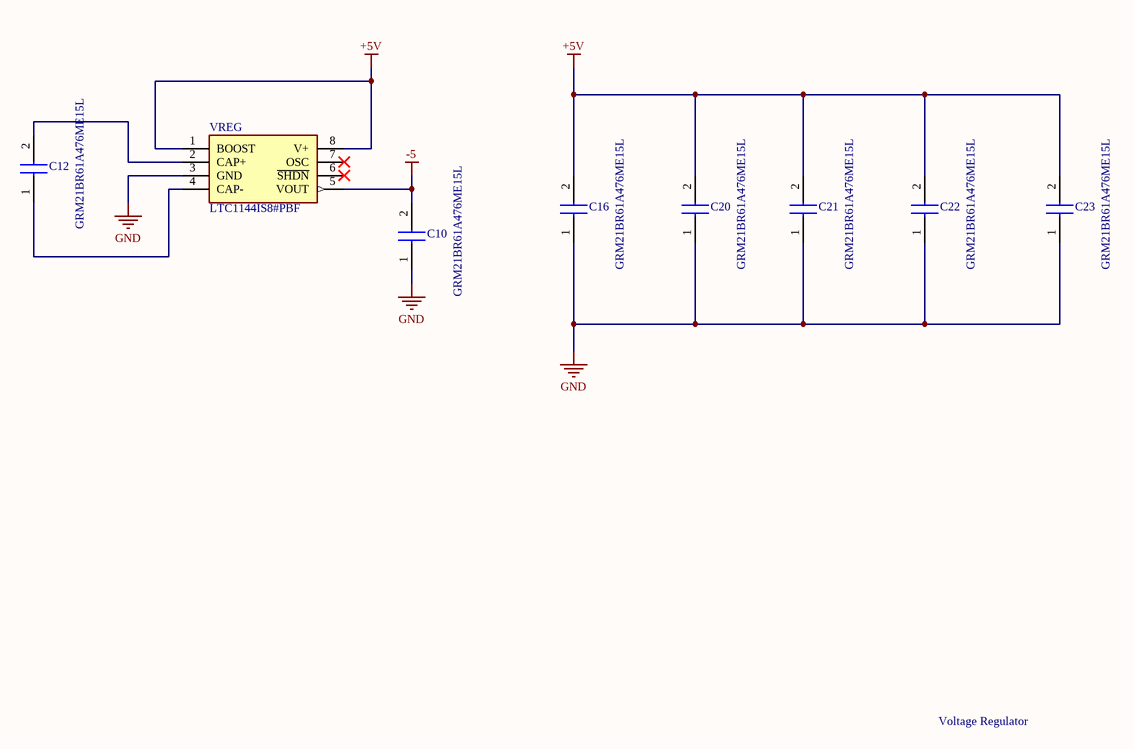
[diagram p4: vreg.SchDoc]

### Parts
C10  GRM21BR61A476ME15L  [CAPC2012X145N]
C12  GRM21BR61A476ME15L  [CAPC2012X145N]
C16  GRM21BR61A476ME15L  [CAPC2012X145N]
C20  GRM21BR61A476ME15L  [CAPC2012X145N]
C21  GRM21BR61A476ME15L  [CAPC2012X145N]
C22  GRM21BR61A476ME15L  [CAPC2012X145N]
C23  GRM21BR61A476ME15L  [CAPC2012X145N]
VREG  LTC1144IS8#PBF  [SOIC127P599X175-8N]

### Nets
+5V: C16.2 C20.2 C21.2 C22.2 C23.2 VREG.1(BOOST) VREG.8(V+)
-5: C10.2 VREG.5(VOUT)
GND: C10.1 C16.1 C20.1 C21.1 C22.1 C23.1 VREG.3(GND)
NetC12_1: C12.1 VREG.4(CAP-)
NetC12_2: C12.2 VREG.2(CAP+)

Not connected (* = marked no-connect by the designer): VREG 6(~{SHDN})* 7(OSC)*

### Notes on the sheet
- Voltage Regulator

### Library data of the parts
C10 C12 C16 C20-C23 = GRM21BR61A476ME15L: Capacitor; Manufacturer_Name: Murata Electronics; Datasheet Link: https://search.murata.co.jp/Ceramy/image/img/A01X/G101/ENG/GRM21BR61A476ME15-01A.pdf; Height: 1.45mm; Manufacturer_Part_Number: GRM21BR61A476ME15L; Mouser Part Number: 81-GRM21BR61A476ME5L; Mouser Price/Stock: https://www.mouser.co.uk/ProductDetail/Murata-Electronics/GRM21BR61A476ME15L?qs=hNud%2FORuBR2%2FEB7WUpdltg%3D%3D; Arrow Part Number: GRM21BR61A476ME15L; Arrow Price/Stock: https://www.arrow.com/en/products/grm21br61a476me15l/murata-manufacturing?utm_currency=USD&region=nac
VREG = LTC1144IS8#PBF: Integrated Circuit; Manufacturer_Name: Analog Devices; Datasheet Link: http://cds.linear.com/docs/en/datasheet/1144fa.pdf; Height: 1.752mm; Manufacturer_Part_Number: LTC1144IS8#PBF; Mouser Part Number: 584-LTC1144IS8#PBF; Mouser Price/Stock: https://www.mouser.co.uk/ProductDetail/Analog-Devices/LTC1144IS8PBF?qs=hVkxg5c3xu%2FkbkSDzzDboA%3D%3D; Arrow Part Number: LTC1144IS8#PBF; Arrow Price/Stock: https://www.arrow.com/en/products/ltc1144is8pbf/analog-devices?utm_currency=USD&region=europe

## Nets that join several sheets
+3V3: DAC_ADC (AD1.1 C8.2), processor (7 pins)
+5V: DAC_ADC (C15.2 DA1.6 OP3.8), boost_converter (IC1.8 IC1.10 L1.4 R9.2), current_mirror (OP2.8), processor (12 pins), vreg (7 pins)
-5: DAC_ADC (OP3.4 R4.2), current_mirror (OP2.4), vreg (C10.2 VREG.5)
GND: DAC_ADC (7 pins), boost_converter (16 pins), current_mirror (6 pins), processor (25 pins), vreg (7 pins)
+300V: boost_converter (6 pins), current_mirror (R6.2 R7.2)
AD_CS: DAC_ADC (AD1.6), processor (ESP32-S3.7)
AD_MISO: DAC_ADC (AD1.5), processor (ESP32-S3.10)
ADIN: DAC_ADC (AD1.3), current_mirror (C3.2 R29.2)
DA_CS: DAC_ADC (DA1.5), processor (ESP32-S3.8)
DA_MOSI: DAC_ADC (DA1.4), processor (ESP32-S3.11)
SPI_CLK: DAC_ADC (AD1.4 DA1.3), processor (ESP32-S3.9)
VOUT: DAC_ADC (C4.1 DA1.8 OP3.1), current_mirror (OP2.3 R26.1)
VPP: current_mirror (J4.1 J4.MP1), processor (8 pins)